# EAGLE board EMC03-Motion Control (EAGLE 7.4.0), part 1 of 2
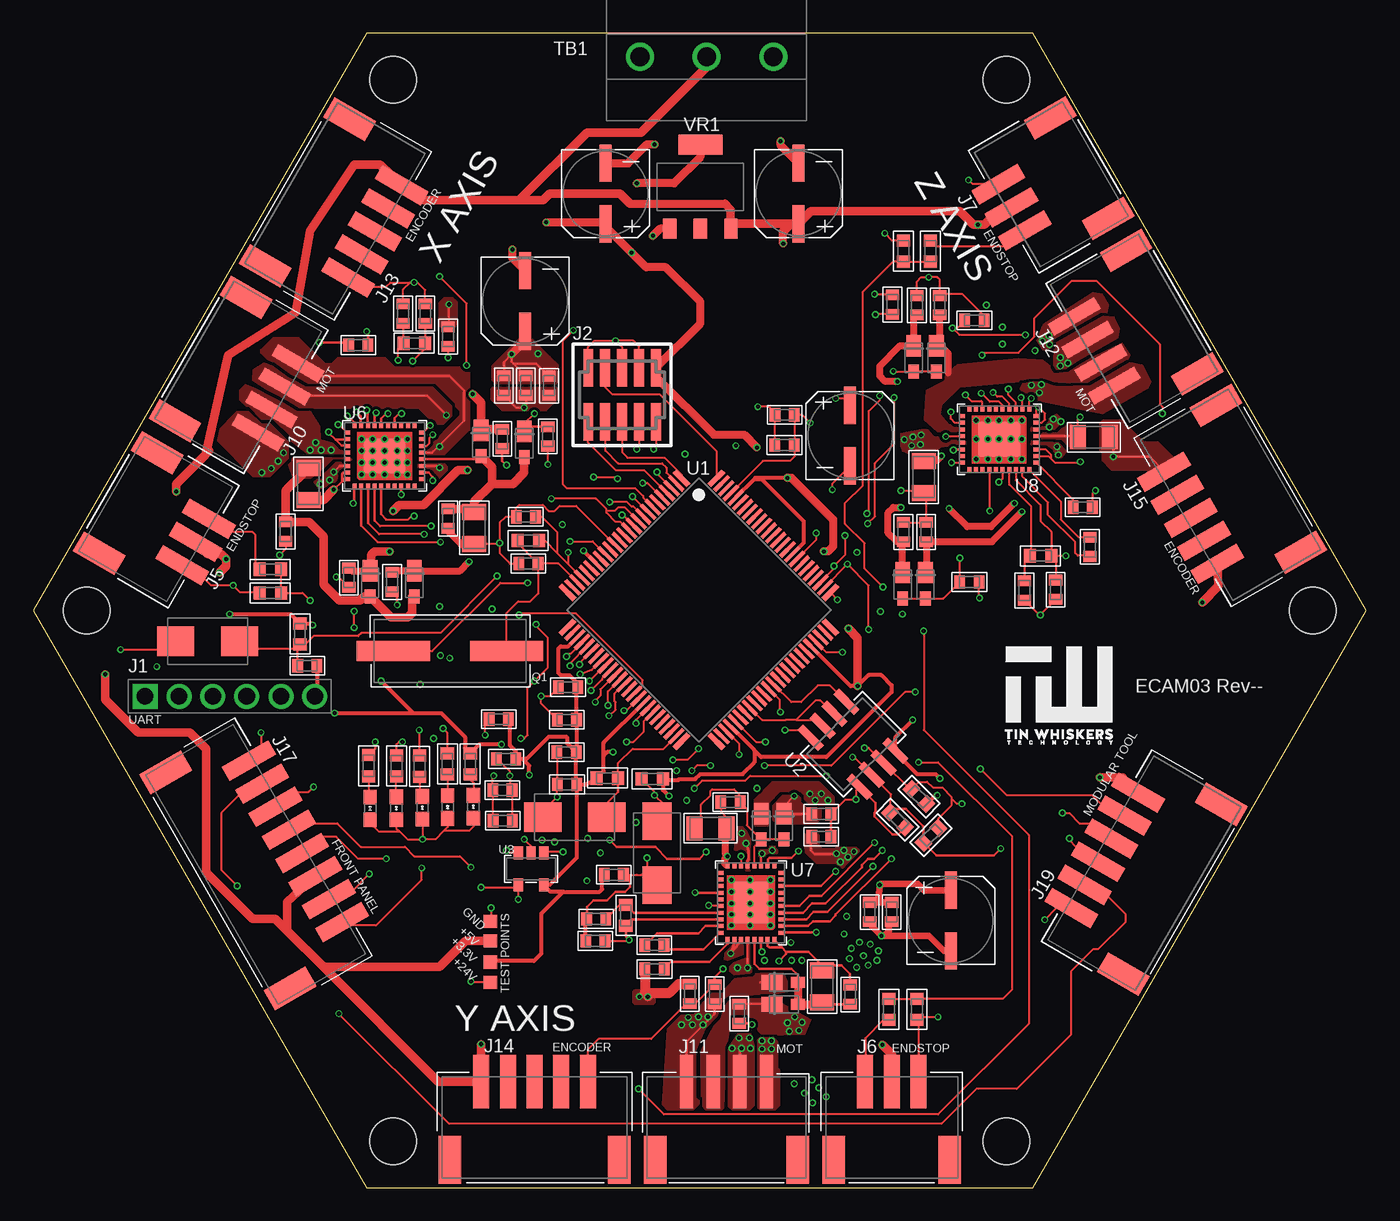
[diagram p3: board, top side]
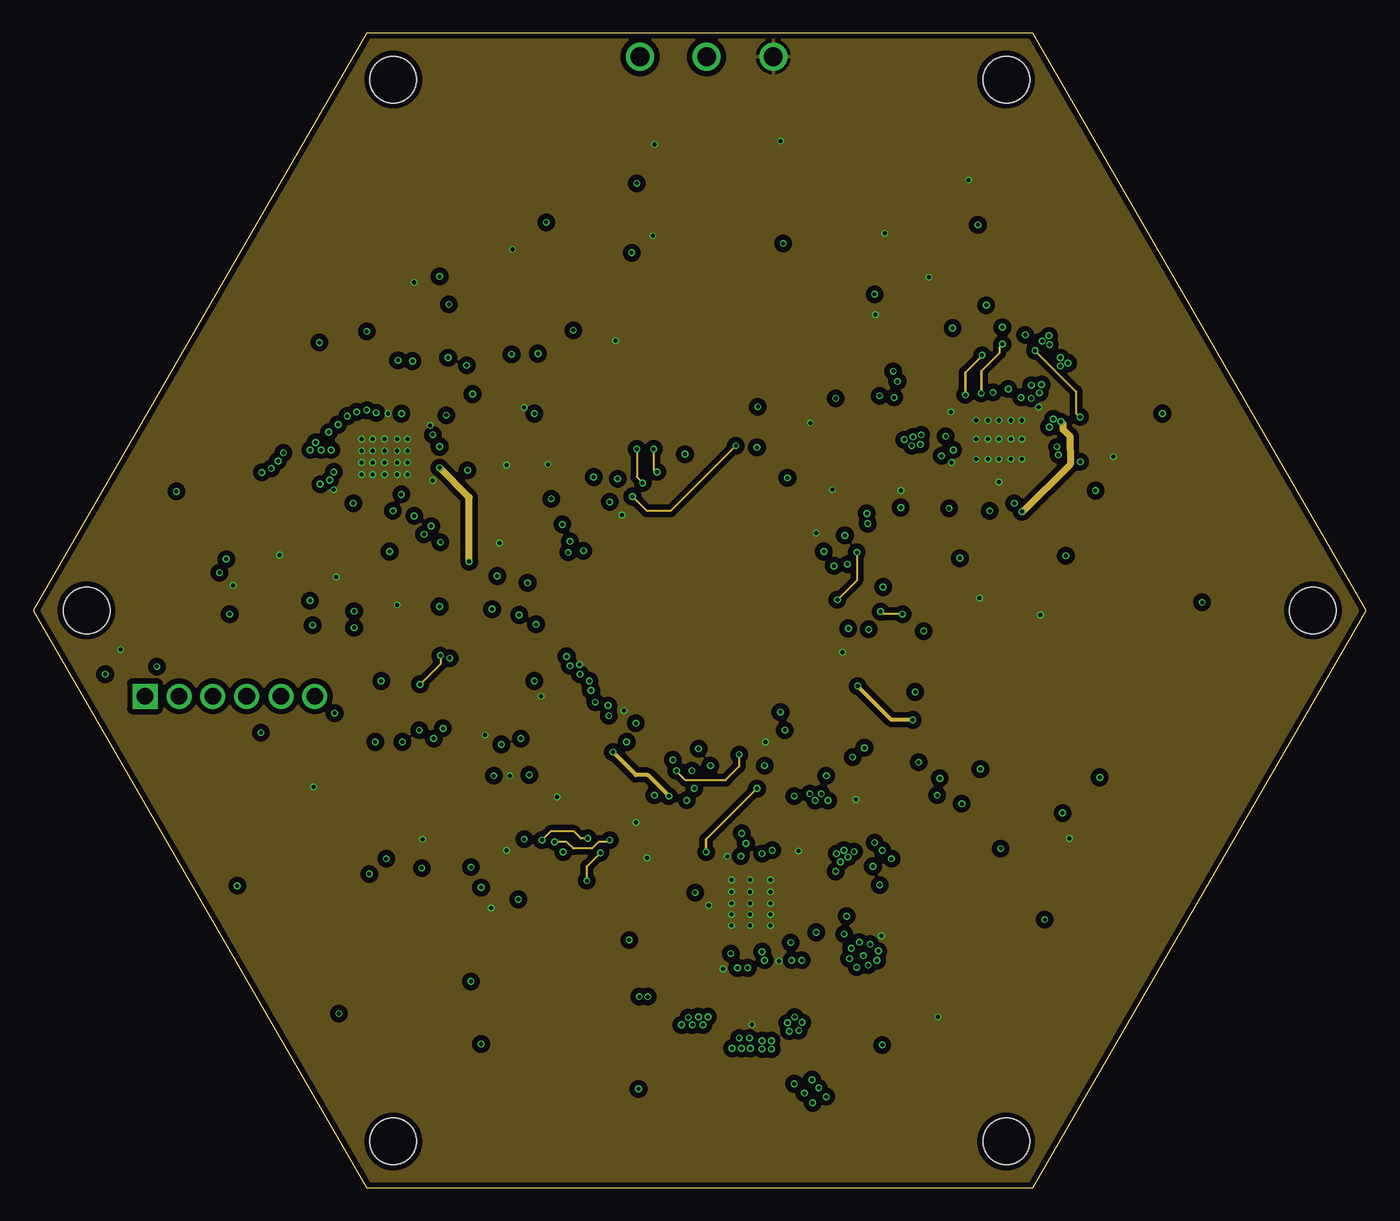
[diagram p4: board, inner layer Route2]
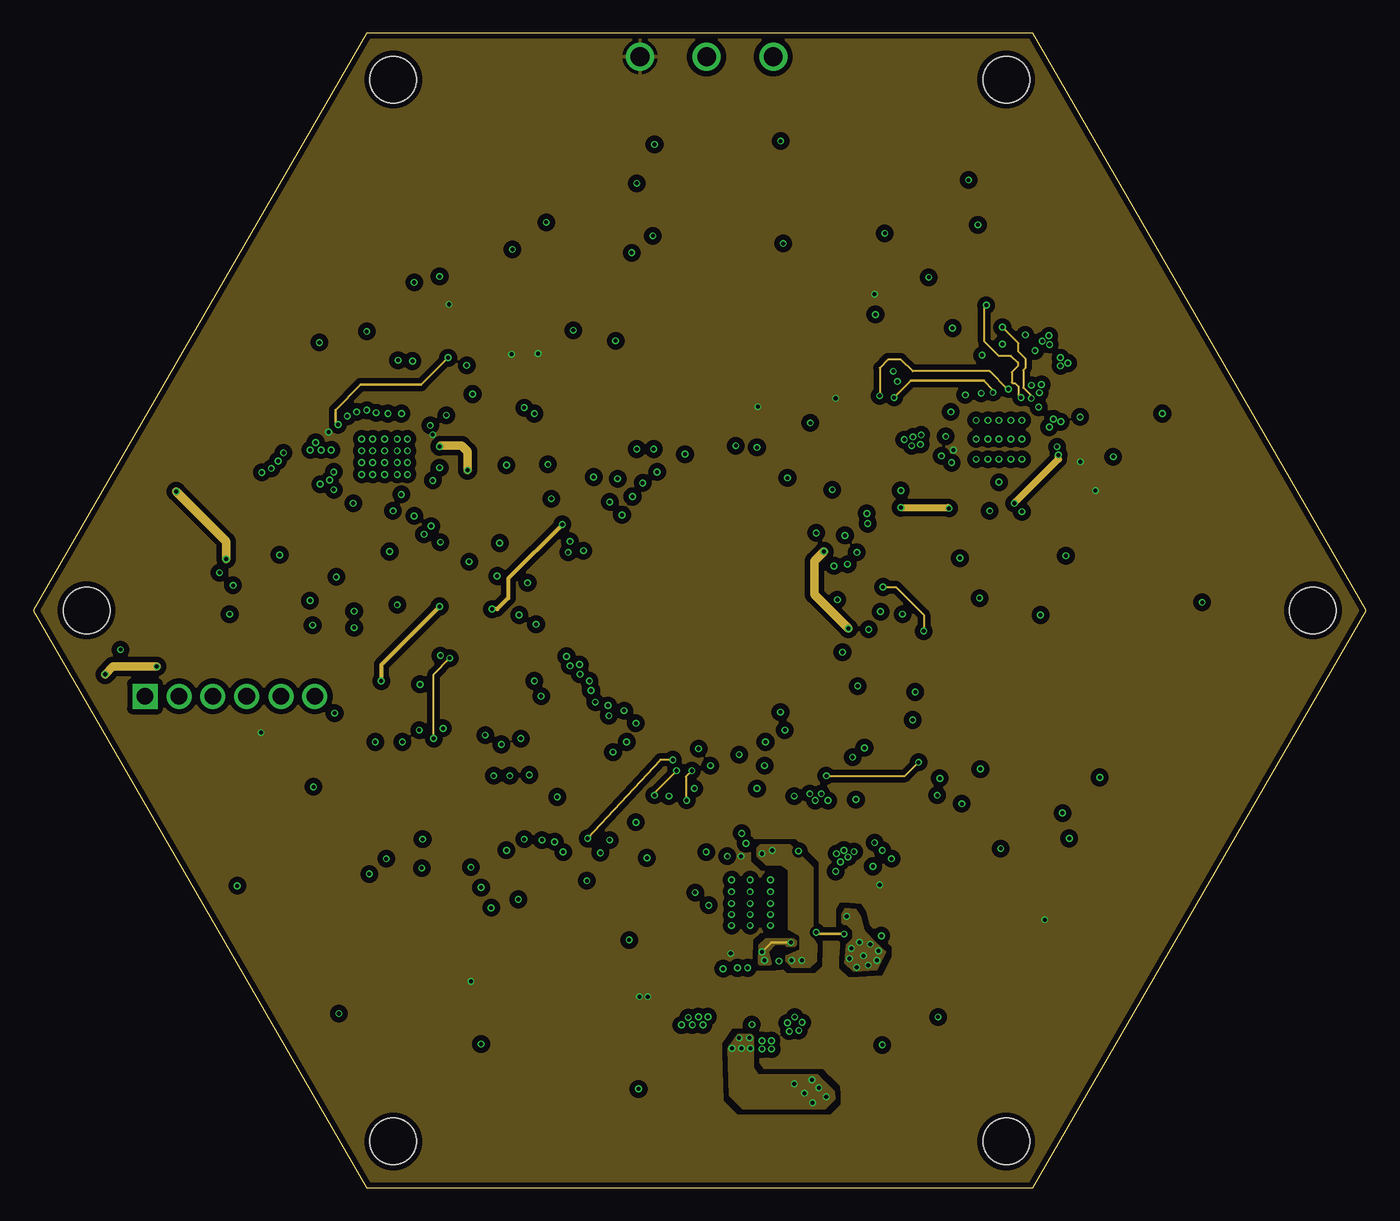
[diagram p5: board, inner layer Route15]
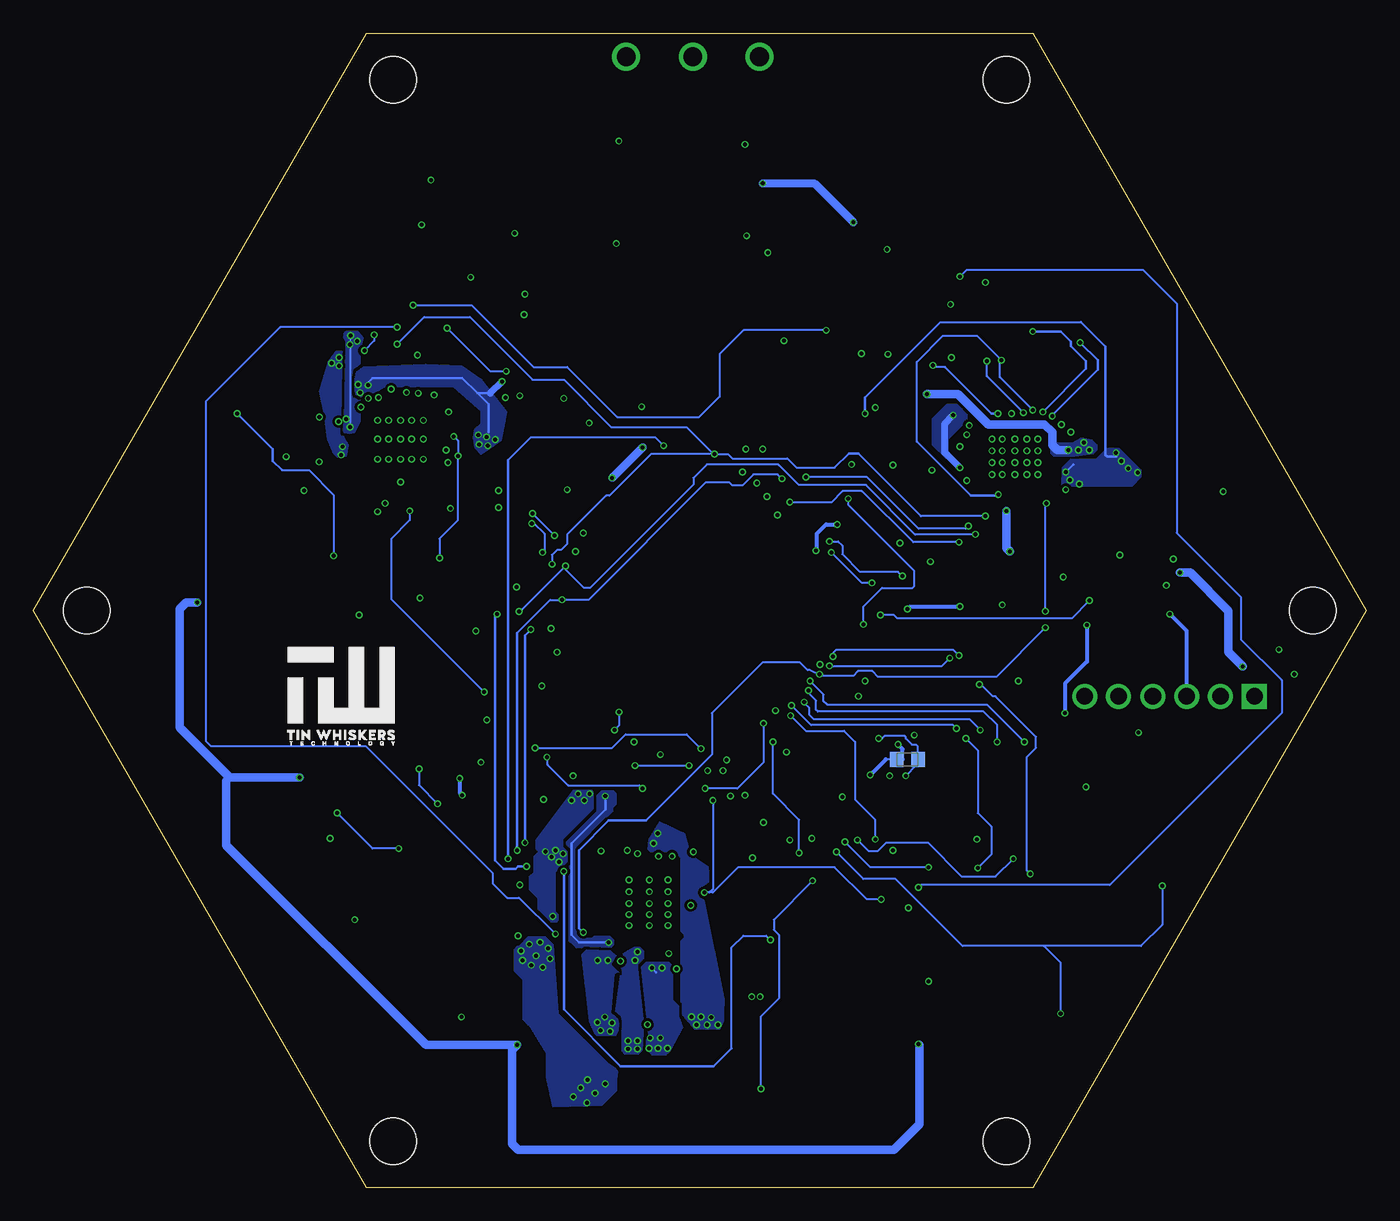
[diagram p6: board, bottom side, seen from below]

Size 100 x 86.6 mm. Coordinates in mm from the lower left corner, seen from the top.
Outline: 25,0 75,0 100,43.3 75,86.6 25,86.6 0,43.3 25,0
Copper layers (1*2*15*16): Top 0.035mm / dielectric 0.2mm / Route2 0.0175mm / dielectric 0.3mm / Route15 0.0175mm / dielectric 0.2mm / Bottom 0.035mm
Design rules "HQPCB_4layer_DRU_no_angle": minimum track width 6mil, minimum drill 12mil, track to track 8mil, track to pad 8mil, pad to pad 6mil, via to via 8mil, smd to smd 0mil, copper to edge 10mil, drill to drill 8mil, minimum pad ring 6mil, minimum via ring 4mil, stop-mask expansion 2mil, vias tented up to drill 100mil, thermal gap 10mil
Net classes: 0 default: width 0.152 mm, drill 0.305 mm, clearance 0.152 mm
Holes 3.5 mm at 4,43.3 27,3.46 73,3.46 96,43.3 27,83.14 73,83.14
tRestrict: area 92.8,40 to 99.2,46.5; area 0.8,40 to 7.2,46.5; area 69.8,0.2 to 76.2,6.7; area 23.8,79.9 to 30.2,86.4; area 69.8,79.9 to 76.2,86.4; area 23.8,0.2 to 30.2,6.7
bRestrict: area 0.8,40 to 7.2,46.5; area 69.8,79.9 to 76.2,86.4; area 92.8,40 to 99.2,46.5; area 23.8,0.2 to 30.2,6.7; area 69.8,0.2 to 76.2,6.7; area 23.8,79.9 to 30.2,86.4

## Footprints (pad centres in the part's own frame; a part is rotated, then mirrored left to right if it is on the bottom)
C0603 = smd 0.8 x 1: 1 -0.725,0; 2 0.725,0
C-SMD-6.3MM = smd 0.9 x 2.8: NEG 0,-2.275; POS 0,2.275
MICRO-SMP = smd 1.6 x 1.1: NEG -0.9,0 | smd 1.05 x 0.8: POS 1.04,0
F0603 = smd 1 x 1.1: 1 -0.8,0; 2 0.8,0
CON-HDR-6POS-MALE = drill 1.25 square: 1 -6.35,0 | drill 1.25: 2 -3.8,0; 3 -1.26,0; 4 1.28,0; 5 3.85,0; 6 6.39,0
FTSH-105-01-XXX-DV-K = smd 0.737 x 2.794: 1 -2.54,-2.032; 2 -2.54,2.032; 3 -1.27,-2.032; 4 -1.27,2.032; 5 0,-2.032; 6 0,2.032; 7 1.27,-2.032; 8 1.27,2.032; 9 2.54,-2.032; 10 2.54,2.032
CONN-JST-PH-2.0MM-3P-SMT-RA = smd 1.2 x 4: 1 2,0; 2 0,0; 3 -2,0 | smd 1.7 x 3.6: NC1 -4.35,5.85; NC2 4.35,5.85
CONN-JST-PH-2.0MM-4P-SMT-RA = smd 1 x 4: 1 3,0; 2 1,0; 3 -1,0; 4 -3,0 | smd 1.7 x 3.6: NC1 5.35,5.85; NC2 -5.35,5.85
CONN-JST-PH-2.0MM-5P-SMT-RA = smd 1.2 x 4: 1 4,0; 2 2,0; 3 0,0; 4 -2,0; 5 -4,0 | smd 1.7 x 3.6: NC1 6.35,5.85; NC2 -6.35,5.85
CONN-JST-PH-2.0MM-8P-SMT-RA = smd 1.2 x 4: 1 7,0; 2 5,0; 3 3,0; 4 1,0; 5 -1,0; 6 -3,0; 7 -5,0; 8 -7,0 | smd 1.7 x 3.6: NC1 9.35,5.85; NC2 -9.35,5.85
CONN-JST-PH-2.0MM-6P-SMT-RA = smd 1.2 x 4: 1 5,0; 2 3,0; 3 1,0; 4 -1,0; 5 -3,0; 6 -5,0 | smd 1.7 x 3.6: NC1 7.35,5.85; NC2 -7.35,5.85
LED0603 = smd 1.1 x 1: A -0.85,0; C 0.85,0
HC-49/U-S = smd 5.5 x 1.5: 1 -4.25,0; 2 4.25,0
R1206 = smd 1.2 x 1.8: 1 -1.2,0; 2 1.2,0
R0603 = smd 0.9 x 1: 1 -0.8,0; 2 0.8,0
147873-2 = smd 2.8 x 2.2: 1 -2.4,0; 2 2.4,0
TBLOCK-3-5MM-OSTTH030160 = drill 1.4: 1 -5,0; 2 0,0; 3 5,0
TESTPAD = smd 1 x 1: PAD 0,0
100-LQFP = smd 0.4 x 1.5: 1 -6.05,-7.9; 25 6.05,-7.9; 51 6.05,7.9; 75 -6.05,7.9 | smd 0.28 x 1.5: 2 -5.5,-7.9; 3 -5,-7.9; 4 -4.5,-7.9; 5 -4,-7.9; 6 -3.5,-7.9; 7 -3,-7.9; 8 -2.5,-7.9; 9 -2,-7.9; 10 -1.5,-7.9; 11 -1,-7.9; 12 -0.5,-7.9; 13 0,-7.9; 14 0.5,-7.9; 15 1,-7.9; 16 1.5,-7.9; 17 2,-7.9; 18 2.5,-7.9; 19 3,-7.9; 20 3.5,-7.9; 21 4,-7.9; 22 4.5,-7.9; 23 5,-7.9; 24 5.5,-7.9; 52 5.5,7.9; 53 5,7.9; 54 4.5,7.9; 55 4,7.9; 56 3.5,7.9; 57 3,7.9; 58 2.5,7.9; 59 2,7.9; 60 1.5,7.9; 61 1,7.9; 62 0.5,7.9; 63 0,7.9; 64 -0.5,7.9; 65 -1,7.9; 66 -1.5,7.9; 67 -2,7.9; 68 -2.5,7.9; 69 -3,7.9; 70 -3.5,7.9; 71 -4,7.9; 72 -4.5,7.9; 73 -5,7.9; 74 -5.5,7.9 | smd 1.5 x 0.4: 26 7.9,-6.05; 50 7.9,6.05; 76 -7.9,6.05; 100 -7.9,-6.05 | smd 1.5 x 0.28: 27 7.9,-5.5; 28 7.9,-5; 29 7.9,-4.5; 30 7.9,-4; 31 7.9,-3.5; 32 7.9,-3; 33 7.9,-2.5; 34 7.9,-2; 35 7.9,-1.5; 36 7.9,-1; 37 7.9,-0.5; 38 7.9,0; 39 7.9,0.5; 40 7.9,1; 41 7.9,1.5; 42 7.9,2; 43 7.9,2.5; 44 7.9,3; 45 7.9,3.5; 46 7.9,4; 47 7.9,4.5; 48 7.9,5; 49 7.9,5.5; 77 -7.9,5.5; 78 -7.9,5; 79 -7.9,4.5; 80 -7.9,4; 81 -7.9,3.5; 82 -7.9,3; 83 -7.9,2.5; 84 -7.9,2; 85 -7.9,1.5; 86 -7.9,1; 87 -7.9,0.5; 88 -7.9,0; 89 -7.9,-0.5; 90 -7.9,-1; 91 -7.9,-1.5; 92 -7.9,-2; 93 -7.9,-2.5; 94 -7.9,-3; 95 -7.9,-3.5; 96 -7.9,-4; 97 -7.9,-4.5; 98 -7.9,-5; 99 -7.9,-5.5
SOICN-8 = smd 2.2 x 0.6: 1 -2.6,1.905; 2 -2.6,0.635; 3 -2.6,-0.635; 4 -2.6,-1.905; 5 2.6,-1.905; 6 2.6,-0.635; 7 2.6,0.635; 8 2.6,1.905
SOT-23-5 = smd 0.7 x 1: 1 0.95,1.2; 2 0,1.2; 3 -0.95,1.2; 4 -0.95,-1.2; 5 0.95,-1.2
36-QFN(5X6) = smd 0.45 x 0.3: 1 -2.3,2.25; 2 -2.3,1.75; 3 -2.3,1.25; 4 -2.3,0.75; 5 -2.3,0.25; 6 -2.3,-0.25; 7 -2.3,-0.75; 8 -2.3,-1.25; 9 -2.3,-1.75; 10 -2.3,-2.25; 19 2.3,-2.25; 20 2.3,-1.75; 21 2.3,-1.25; 22 2.3,-0.75; 23 2.3,-0.25; 24 2.3,0.25; 25 2.3,0.75; 26 2.3,1.25; 27 2.3,1.75; 28 2.3,2.25 | smd 0.3 x 0.45: 11 -1.75,-2.8; 12 -1.25,-2.8; 13 -0.75,-2.8; 14 -0.25,-2.8; 15 0.25,-2.8; 16 0.75,-2.8; 17 1.25,-2.8; 18 1.75,-2.8; 29 1.75,2.8; 30 1.25,2.8; 31 0.75,2.8; 32 0.25,2.8; 33 -0.25,2.8; 34 -0.75,2.8; 35 -1.25,2.8; 36 -1.75,2.8 | smd 2.6 x 3.1: PAD 0,0
SOT-223 = smd 1 x 1.5: 1 -2.3,-3.15; 2 0,-3.15; 3 2.3,-3.15 | smd 3.3 x 1.5: P$1 0,3.15

## Placement (x,y rotation side)
C1  12pF  [C0603]  36.96,50.32 0 top
C2  0.1uF  [C0603]  43.56,23.46 0 top
C3  10uF  [C-SMD-6.3MM]  57.4,74.58 180 top
C4  10uF  [C-SMD-6.3MM]  42.93,74.58 180 top
C5  0.1uF  [C0603]  40.12,37.53 0 top
C6  10nF  [C0603]  40.03,35.11 0 top
C7  0.1uF  [C0603]  40,32.66 0 top
C8  10nF  [C0603]  40.04,30.24 0 top
C9  0.1uF  [C0603]  34.92,35.15 0 top
C10  10nF  [C0603]  35.47,32.16 0 top
C11  4.7uF  [C0603]  27.75,65.56 270 top
C12  4.7uF  [C0603]  29.4,65.56 270 top
C13  4.7uF  [C0603]  42.16,18.51 0 top
C14  4.7uF  [C0603]  42.23,20.16 0 top
C15  100 nF  [C0603]  78.73,51.04 0 top
C16  470nF  [C0603]  64.46,66.24 90 top
C17  100nF  [C0603]  56.36,55.7 0 top
C18  4.7uF  [C0603]  76.71,44.86 90 top
C19  4.7uF  [C0603]  74.36,44.8 90 top
C20  100uF  [C-SMD-6.3MM]  36.89,66.52 180 top
C21  100uF  [C-SMD-6.3MM]  61.28,56.42 0 top
C22  100uF  [C-SMD-6.3MM]  68.83,20.03 0 top
C27  10nF  [C0603]  35.2,29.82 180 top
C28  0.1uF  [C0603]  35.22,27.52 180 top
C29  0.1uF  [C0603]  20.56,39.15 180 top
C39  100 nF  [C0603]  31.11,63.85 90 top
C40  470nF  [C0603]  38.69,60.15 90 top
C41  100nF  [C0603]  35.31,60.17 270 top
C42  100nF  [C0603]  36.96,60.17 270 top
C43  470pF  [C0603]  23.69,45.75 270 top
C44  470pF  [C0603]  26.92,45.43 270 top
C45  470pF  [C0603]  35.18,56.16 270 top
C46  470pF  [C0603]  38.61,56.36 270 top
C47  100nF  [C0603]  31.11,50.2 270 top
C48  100nF  [C0603]  18.93,49.21 270 top
C49  22 nF  [C0603]  24.38,63.2 180 top
C52  100nF  [C0603]  56.36,57.98 0 top
C53  470pF  [C0603]  66.29,66.2 90 top
C54  470pF  [C0603]  68.01,66.2 90 top
C55  470pF  [C0603]  65.28,49.18 90 top
C56  470pF  [C0603]  66.99,49.18 90 top
C57  100nF  [C0603]  70.23,45.43 0 top
C58  100nF  [C0603]  70.61,65.05 0 top
C59  22 nF  [C0603]  79.27,48.07 90 top
C62  100 nF  [C0603]  46.6,16.4 180 top
C63  470nF  [C0603]  49.24,14.53 90 top
C64  100nF  [C0603]  62.74,20.67 270 top
C65  100nF  [C0603]  64.39,20.67 270 top
C66  470pF  [C0603]  51.12,14.51 90 top
C67  470pF  [C0603]  52.96,13.05 270 top
C68  470pF  [C0603]  59.12,26.32 0 top
C69  470pF  [C0603]  59.12,28.03 0 top
C70  100nF  [C0603]  52.3,28.91 180 top
C71  100nF  [C0603]  61.28,14.48 90 top
C72  22 nF  [C0603]  46.59,18.18 0 top
C75  12pF  [C0603]  37.14,46.82 0 top
D3  MSS1P6  [MICRO-SMP]  25.27,45.37 270 top
D4  MSS1P6  [MICRO-SMP]  28.57,45.37 270 top
D5  MSS1P6  [MICRO-SMP]  33.59,55.91 270 top
D6  MSS1P6  [MICRO-SMP]  36.83,55.85 270 top
D7  MSS1P6  [MICRO-SMP]  66.04,62.26 270 top
D8  MSS1P6  [MICRO-SMP]  67.75,62.26 270 top
D9  MSS1P6  [MICRO-SMP]  65.21,45.24 270 top
D10  MSS1P6  [MICRO-SMP]  66.93,45.24 270 top
D11  MSS1P6  [MICRO-SMP]  56.32,15.4 0 top
D12  MSS1P6  [MICRO-SMP]  56.32,13.75 0 top
D13  MSS1P6  [MICRO-SMP]  54.61,27.15 270 top
D14  MSS1P6  [MICRO-SMP]  56.32,27.15 270 top
FB2  120R  [F0603]  34.42,32.12 180 bottom
J1  UART0  [CON-HDR-6POS-MALE]  14.73,36.86 0 top
J2  FTSH-105-1-L-DV  [FTSH-105-01-XXX-DV-K]  44.17,59.48 180 top
J5  S3B-PH-SM4  [CONN-JST-PH-2.0MM-3P-SMT-RA]  12.18,48.44 60 top
J6  S3B-PH-SM4  [CONN-JST-PH-2.0MM-3P-SMT-RA]  64.4,7.95 180 top
J7  S3B-PH-SM4  [CONN-JST-PH-2.0MM-3P-SMT-RA]  73.4,73.55 300 top
J10  S4B-PH-SM4  [CONN-JST-PH-2.0MM-4P-SMT-RA]  18.36,59.24 60 top
J11  S4B-PH-SM4  [CONN-JST-PH-2.0MM-4P-SMT-RA]  52,7.95 180 top
J12  S4B-PH-SM4  [CONN-JST-PH-2.0MM-4P-SMT-RA]  79.6,62.76 300 top
J13  S5B-PH-SM4  [CONN-JST-PH-2.0MM-5P-SMT-RA]  25.63,71.74 60 top
J14  S5B-PH-SM4  [CONN-JST-PH-2.0MM-5P-SMT-RA]  37.6,7.95 180 top
J15  S5B-PH-SM4  [CONN-JST-PH-2.0MM-5P-SMT-RA]  86.84,50.25 300 top
J17  S8B-PH-SM4  [CONN-JST-PH-2.0MM-8P-SMT-RA]  19.67,25.97 120 top
J19  S6B-PH-SM4  [CONN-JST-PH-2.0MM-6P-SMT-RA]  80.38,25.3 240 top
LED1  GREEN  [LED0603]  31.08,28.55 270 top
LED2  GREEN  [LED0603]  29.2,28.49 270 top
LED3  GREEN  [LED0603]  27.23,28.46 270 top
LED4  GREEN  [LED0603]  25.27,28.45 270 top
LED5  RED  [LED0603]  33.02,28.57 270 top
Q1  12MHz  [HC-49/U-S]  31.25,40.25 0 top
R1  0.22  [R1206]  79.57,56.29 180 top
R2  0.22  [R1206]  66.8,53.31 90 top
R3  1M  [R0603]  37.13,48.54 180 top
R4  10k  [R0603]  46.43,30.65 0 top
R5  10k  [R0603]  43.07,30.72 180 top
R6  470R  [R0603]  31.07,31.78 90 top
R7  470R  [R0603]  28.98,31.6 90 top
R8  470R  [R0603]  27.25,31.63 90 top
R9  470R  [R0603]  25.16,31.64 90 top
R10  2R2  [R0603]  28.57,63.34 180 top
R11  2R2  [R0603]  75.56,47.39 0 top
R12  2R2  [R0603]  44.45,20.41 270 top
R18  10k  [R0603]  20,41.54 90 top
R19  20K  [R0603]  17.78,44.61 0 top
R20  20K  [R0603]  66.29,13.37 90 top
R21  20K  [R0603]  65.28,70.26 270 top
R24  10K  [R0603]  67.31,70.26 90 top
R25  10K  [R0603]  64.2,13.37 270 top
R26  10K  [R0603]  17.78,46.39 180 top
R38  1K  [R0603]  66.44,29.33 315 top
R39  1K  [R0603]  64.85,27.59 135 top
R40  120R  [R0603]  67.34,26.43 45 top
R41  470R  [R0603]  32.78,31.79 90 top
R44  0.22  [R1206]  20.64,52.8 90 top
R45  0.22  [R1206]  33.08,49.5 90 top
R46  0.22  [R1206]  59.18,15.08 270 top
R47  0.22  [R1206]  50.8,26.96 180 top
S1  147873-2  [147873-2]  13.09,40.98 0 top
S2  147873-2  [147873-2]  46.8,25.09 90 top
S3  147873-2  [147873-2]  40.62,27.79 0 top
TB1  DC-IN  [TBLOCK-3-5MM-OSTTH030160]  50.51,84.85 0 top
TP1  +3.3V  [TESTPAD]  34.29,16.92 90 top
TP2  +3.3V  [TESTPAD]  34.29,18.51 90 top
TP3  +24V  [TESTPAD]  34.29,15.4 90 top
TP4  GND  [TESTPAD]  34.29,19.97 90 top
U1  LPC1768  [100-LQFP]  49.94,43.35 225 top
U2  SP3485  [SOICN-8]  61.5,33.26 315 top
U3  74LVC  [SOT-23-5]  37.34,23.91 0 top
U6  TMC2130-LA  [36-QFN(5X6)]  26.35,54.89 90 top
U7  TMC2130-LA  [36-QFN(5X6)]  53.85,21.37 180 top
U8  TMC2130-LA  [36-QFN(5X6)]  72.46,56.13 270 top
U$1  TIN-WHISKERSSMALL  [TIN-WHISKERS-SMALL]  72.45,32.99 0 top
U$2  TIN-WHISKERSSMALL  [TIN-WHISKERS-SMALL]  81.41,32.92 0 bottom
VR1  LMS8117AMP-3.3/NOPB  [SOT-223]  50.04,75.09 0 top